# EAGLE design VCO-Simple-Back (EAGLE 9.1.0)

## Sheet 1 of 3: OSCILLATOR
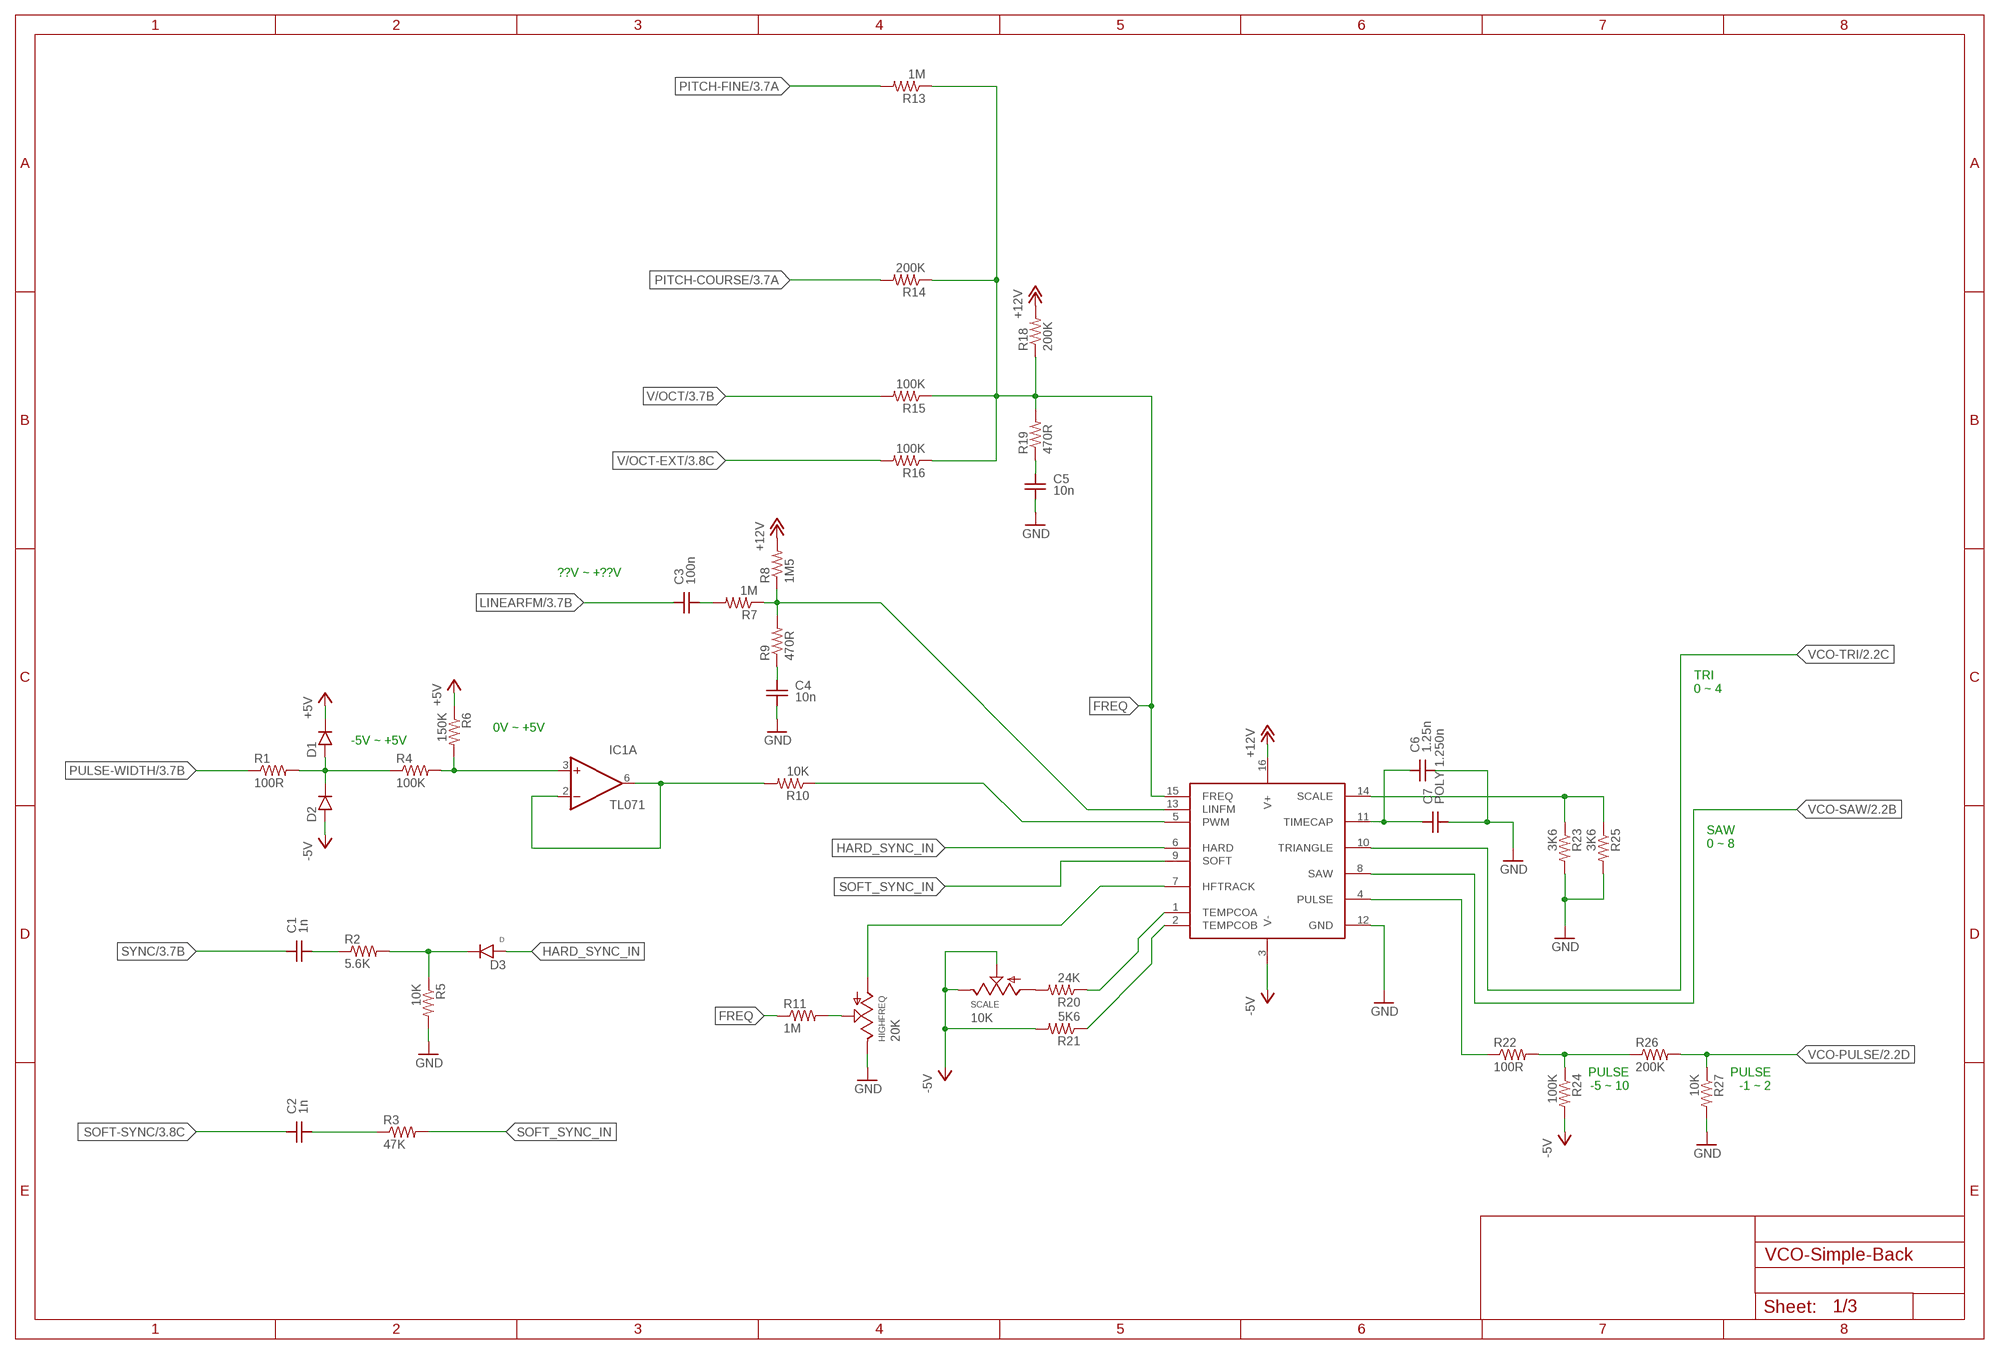
[diagram p0: schematic, sheet 1]

### Parts
C1  1n  CAPACITOR0805  [C-0805]
C2  1n  CAPACITOR0805  [C-0805]
C3  100n  CAPACITOR0805  [C-0805]
C4  10n  CAPACITOR0805  [C-0805]
C5  10n  CAPACITOR0805  [C-0805]
C6  1.25n  CAPACITOR0805  [C-0805]
C7  POLY 1.250n  CAPACITOR5MM  [CAP-5MM]
D1  DIODESOD-323  [SOD-323]
D2  DIODESOD-323  [SOD-323]
D3  D  DIODESOD-323  [SOD-323]
HIGHFREQ  20K  POTTRIM-MULTITURN-VERT  [POT-TRIM-MULTI-V]
IC1  TL071  OPAMP-SINGLE  [SO08]
IC2  V3340SO16  [SO16]
R1  100R  RESISTOR0805  [R-0805-MILL]
R2  5.6K  RESISTOR0805  [R-0805-MILL]
R3  47K  RESISTOR0805  [R-0805-MILL]
R4  100K  RESISTOR0805  [R-0805-MILL]
R5  10K  RESISTOR0805  [R-0805-MILL]
R6  150K  RESISTOR0805  [R-0805-MILL]
R7  1M  RESISTOR0805  [R-0805-MILL]
R8  1M5  RESISTOR0805  [R-0805-MILL]
R9  470R  RESISTOR0805  [R-0805-MILL]
R10  10K  RESISTOR0805  [R-0805-MILL]
R11  1M  RESISTOR0805  [R-0805-MILL]
R13  1M  RESISTOR0805  [R-0805-MILL]
R14  200K  RESISTOR0805  [R-0805-MILL]
R15  100K  RESISTOR0805  [R-0805-MILL]
R16  100K  RESISTOR0805  [R-0805-MILL]
R18  200K  RESISTOR0805  [R-0805-MILL]
R19  470R  RESISTOR0805  [R-0805-MILL]
R20  24K  RESISTOR0805  [R-0805-MILL]
R21  5K6  RESISTOR0805  [R-0805-MILL]
R22  100R  RESISTOR0805  [R-0805-MILL]
R23  3K6  RESISTOR0805  [R-0805-MILL]
R24  100K  RESISTOR0805  [R-0805-MILL]
R25  3K6  RESISTOR0805  [R-0805-MILL]
R26  200K  RESISTOR0805  [R-0805-MILL]
R27  10K  RESISTOR0805  [R-0805-MILL]
SCALE  10K  POTTRIM-MULTITURN-VERT  [POT-TRIM-MULTI-V]

### Nets
+5V [pwr]: D1.K(C) R6.P$1 ; also sheet 2,3
+12V [pwr]: IC2.16(V+) R8.P$2 R18.P$2 ; also sheet 2,3
-5V [pwr]: D2.A IC2.3(V-) R21.P$2 R24.P$2 SCALE.B(E) SCALE.W(S) ; also sheet 2,3
FREQ: IC2.15(FREQ) R11.P$1 R13.P$1 R14.P$1 R15.P$1 R16.P$1 R18.P$1 R19.P$2
GND [pwr]: C4.2 C5.2 C6.2 C7.2 HIGHFREQ.B(E) IC2.12(GND) R5.P$2 R23.P$2 R25.P$2 R27.P$2 ; also sheet 2,3
HARD_SYNC_IN: D3.A IC2.6(HARD)
LINEARFM: C3.1 ; also sheet 3
N$3: IC2.5(PWM) R10.P$1
N$4: C6.1 C7.1 IC2.11(TIMECAP)
N$8: HIGHFREQ.W(S) R11.P$2
N$9: R20.P$2 SCALE.A
N$10: IC2.2(TEMPCOB) R21.P$1
N$11: D3.K(C) R2.P$2 R5.P$1
N$12: IC2.14(SCALE) R23.P$1 R25.P$1
N$13: C5.1 R19.P$1
N$14: C3.2 R7.P$2
N$15: IC2.13(LINFM) R7.P$1 R8.P$1 R9.P$2
N$16: C4.1 R9.P$1
N$18: HIGHFREQ.A IC2.7(HFTRACK)
N$19: IC2.1(TEMPCOA) R20.P$1
N$20: D1.A D2.K(C) R1.P$2 R4.P$1
N$22: R22.P$2 R24.P$1 R26.P$1
N$32: C1.2 R2.P$1
N$43: C2.2 R3.P$1
N$44: IC1.3(A:+IN) R4.P$2 R6.P$2
PITCH-COURSE: R14.P$2 ; also sheet 3
PITCH-FINE: R13.P$2 ; also sheet 3
PULSE: IC2.4(PULSE) R22.P$1
PULSE-WIDTH: R1.P$1 ; also sheet 3
PWMIN: IC1.2(A:-IN) IC1.6(A:OUT) R10.P$2
SOFT-SYNC: C2.1 ; also sheet 3
SOFT_SYNC_IN: IC2.9(SOFT) R3.P$2
SYNC: C1.1 ; also sheet 3
V/OCT: R15.P$2 ; also sheet 3
V/OCT-EXT: R16.P$2 ; also sheet 3
VCO-PULSE: R26.P$2 R27.P$1 ; also sheet 2
VCO-SAW: IC2.8(SAW) ; also sheet 2
VCO-TRI: IC2.10(TRIANGLE) ; also sheet 2

### Notes on the sheet
- ??V ~ +??V
- TRI
  0 ~ 4
- 0V ~ +5V
- -5V ~ +5V
- SAW
  0 ~ 8
- PULSE
  -5 ~ 10
- PULSE
  -1 ~ 2

## Sheet 2 of 3: WAVESHAPING
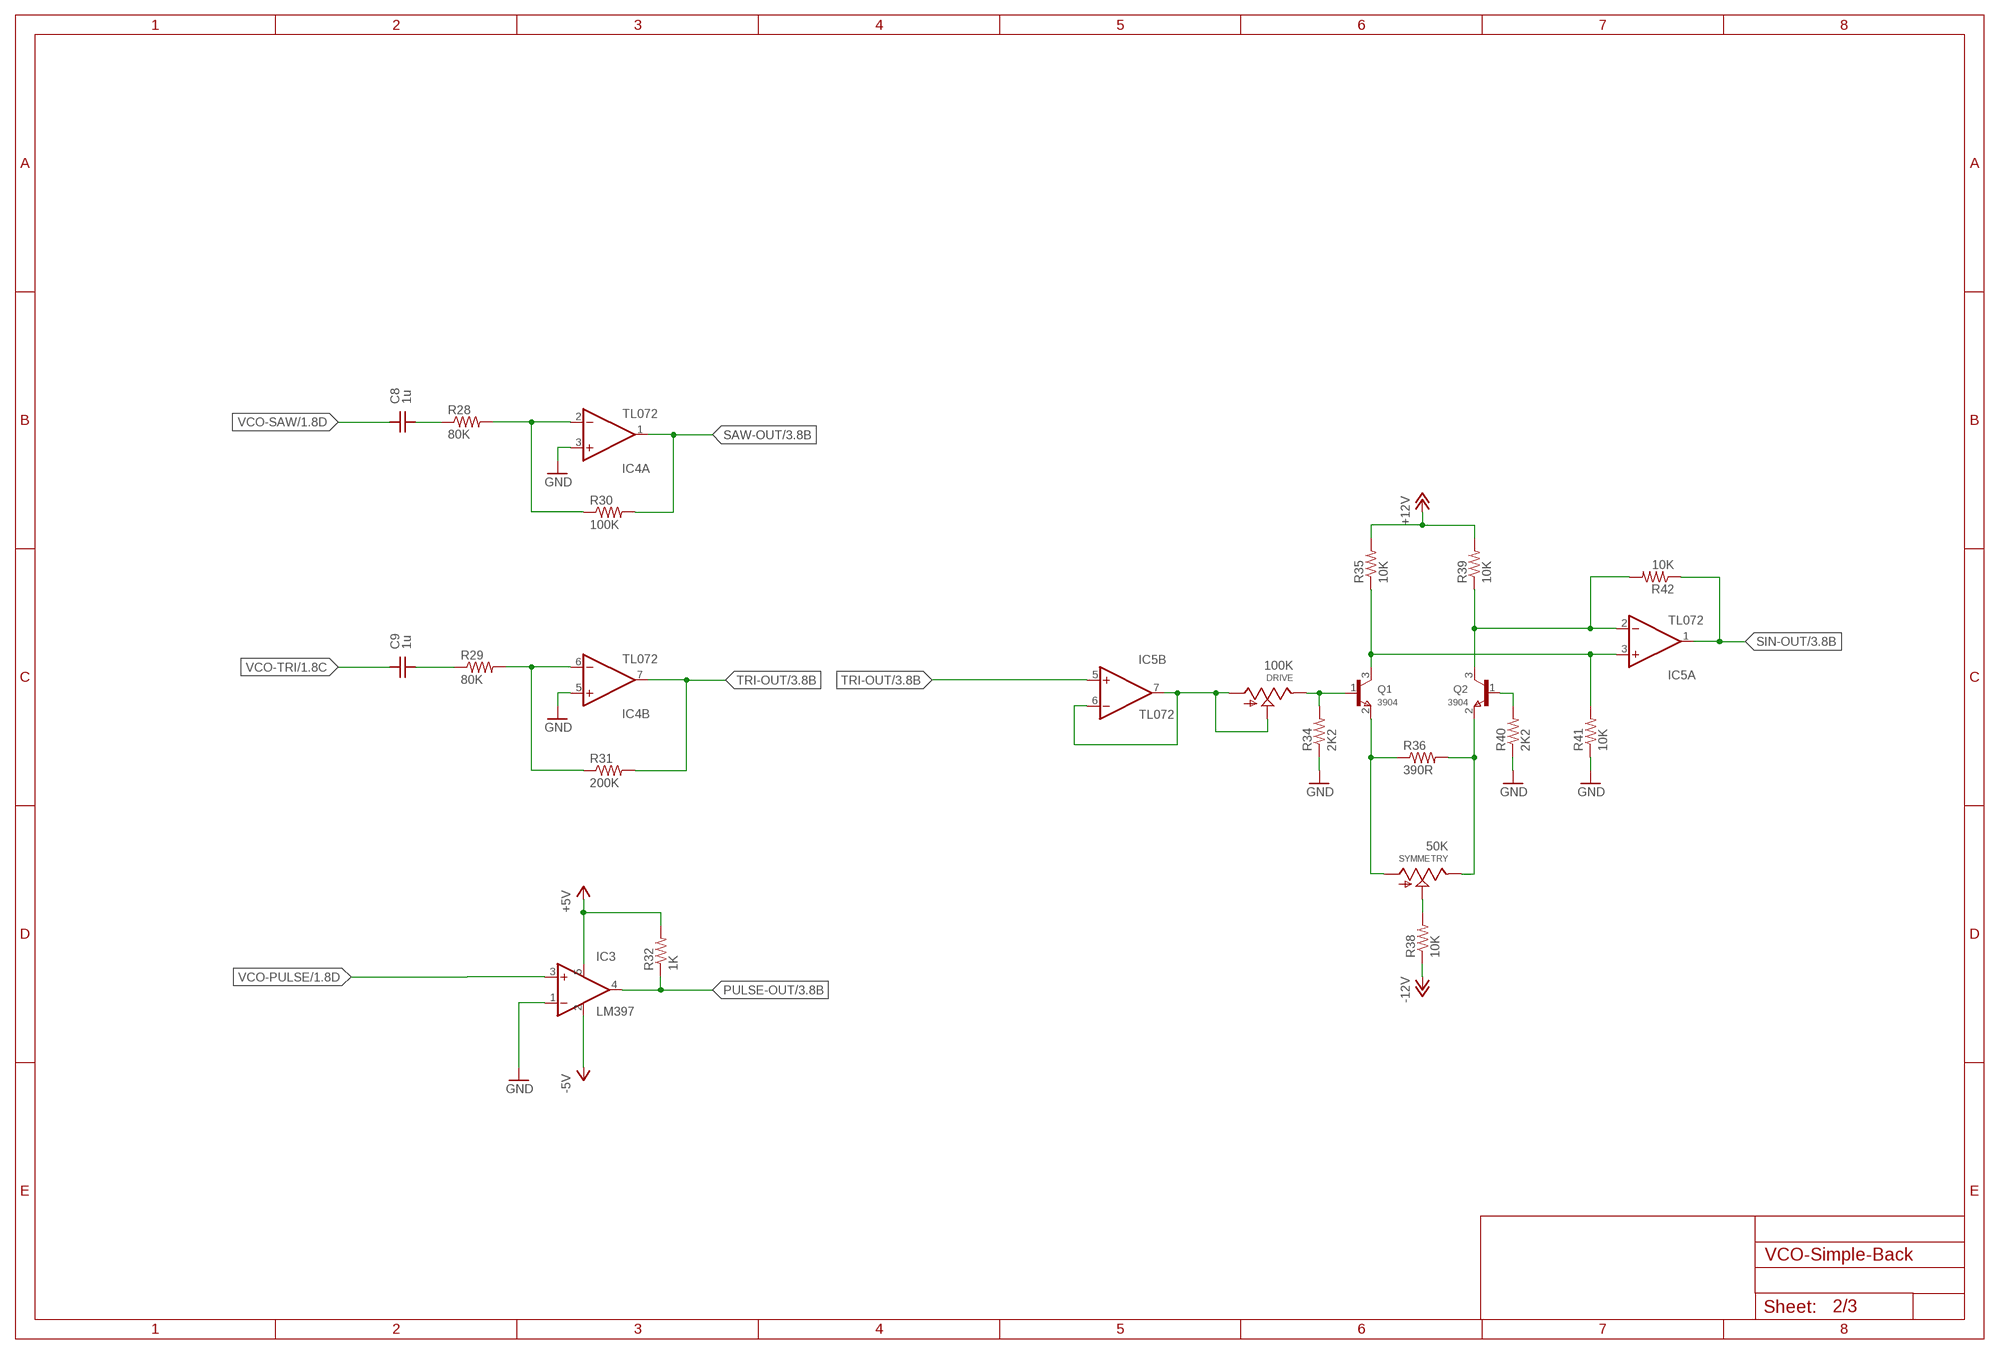
[diagram p1: schematic, sheet 2]

### Parts
C8  1u  CAPACITOR0805  [C-0805]
C9  1u  CAPACITOR0805  [C-0805]
DRIVE  100K  POTTRIM-MULTITURN-VERT  [POT-TRIM-MULTI-V]
IC3  LM397  [SOT23-5]
IC4  TL072  OPAMP-DUAL  [SO08]
IC5  TL072  OPAMP-DUAL  [SO08]
Q1  3904  TRANSISTOR-NPNMMBT3904  [SOT23]
Q2  3904  TRANSISTOR-NPNMMBT3904  [SOT23]
R28  80K  RESISTOR0805  [R-0805-MILL]
R29  80K  RESISTOR0805  [R-0805-MILL]
R30  100K  RESISTOR0805  [R-0805-MILL]
R31  200K  RESISTOR0805  [R-0805-MILL]
R32  1K  RESISTOR0805  [R-0805-MILL]
R34  2K2  RESISTOR0805  [R-0805-MILL]
R35  10K  RESISTOR0805  [R-0805-MILL]
R36  390R  RESISTOR0805  [R-0805-MILL]
R38  10K  RESISTOR0805  [R-0805-MILL]
R39  10K  RESISTOR0805  [R-0805-MILL]
R40  2K2  RESISTOR0805  [R-0805-MILL]
R41  10K  RESISTOR0805  [R-0805-MILL]
R42  10K  RESISTOR0805  [R-0805-MILL]
SYMMETRY  50K  POTTRIM-MULTITURN-VERT  [POT-TRIM-MULTI-V]

### Nets
+5V [pwr]: IC3.5(V+) R32.P$2 ; also sheet 1,3
+12V [pwr]: R35.P$2 R39.P$2 ; also sheet 1,3
-5V [pwr]: IC3.2(GND) ; also sheet 1,3
-12V: R38.P$1 ; also sheet 3
GND [pwr]: IC3.1(-IN) IC4.3(A:+IN) IC4.5(B:+IN) R34.P$1 R40.P$1 R41.P$1 ; also sheet 1,3
N$1: C8.2 R28.P$1
N$2: C9.2 R29.P$1
N$5: IC4.6(B:-IN) R29.P$2 R31.P$1
N$6: IC4.2(A:-IN) R28.P$2 R30.P$1
N$7: DRIVE.A DRIVE.W(S) IC5.6(B:-IN) IC5.7(B:OUT)
N$17: R38.P$2 SYMMETRY.W(S)
N$21: DRIVE.B(E) Q1.1(B) R34.P$2
N$23: Q1.2(E) R36.P$1 SYMMETRY.A
N$24: Q2.2(E) R36.P$2 SYMMETRY.B(E)
N$25: Q2.1(B) R40.P$2
N$27: IC5.2(A:-IN) Q2.3(C) R39.P$1 R42.P$2
N$28: IC5.3(A:+IN) Q1.3(C) R35.P$1 R41.P$2
PULSE-OUT: IC3.4(OUT) R32.P$1 ; also sheet 3
SAW-OUT: IC4.1(A:OUT) R30.P$2 ; also sheet 3
SIN-OUT: IC5.1(A:OUT) R42.P$1 ; also sheet 3
TRI-OUT: IC4.7(B:OUT) IC5.5(B:+IN) R31.P$2 ; also sheet 3
VCO-PULSE: IC3.3(+IN) ; also sheet 1
VCO-SAW: C8.1 ; also sheet 1
VCO-TRI: C9.1 ; also sheet 1

## Sheet 3 of 3: POWER
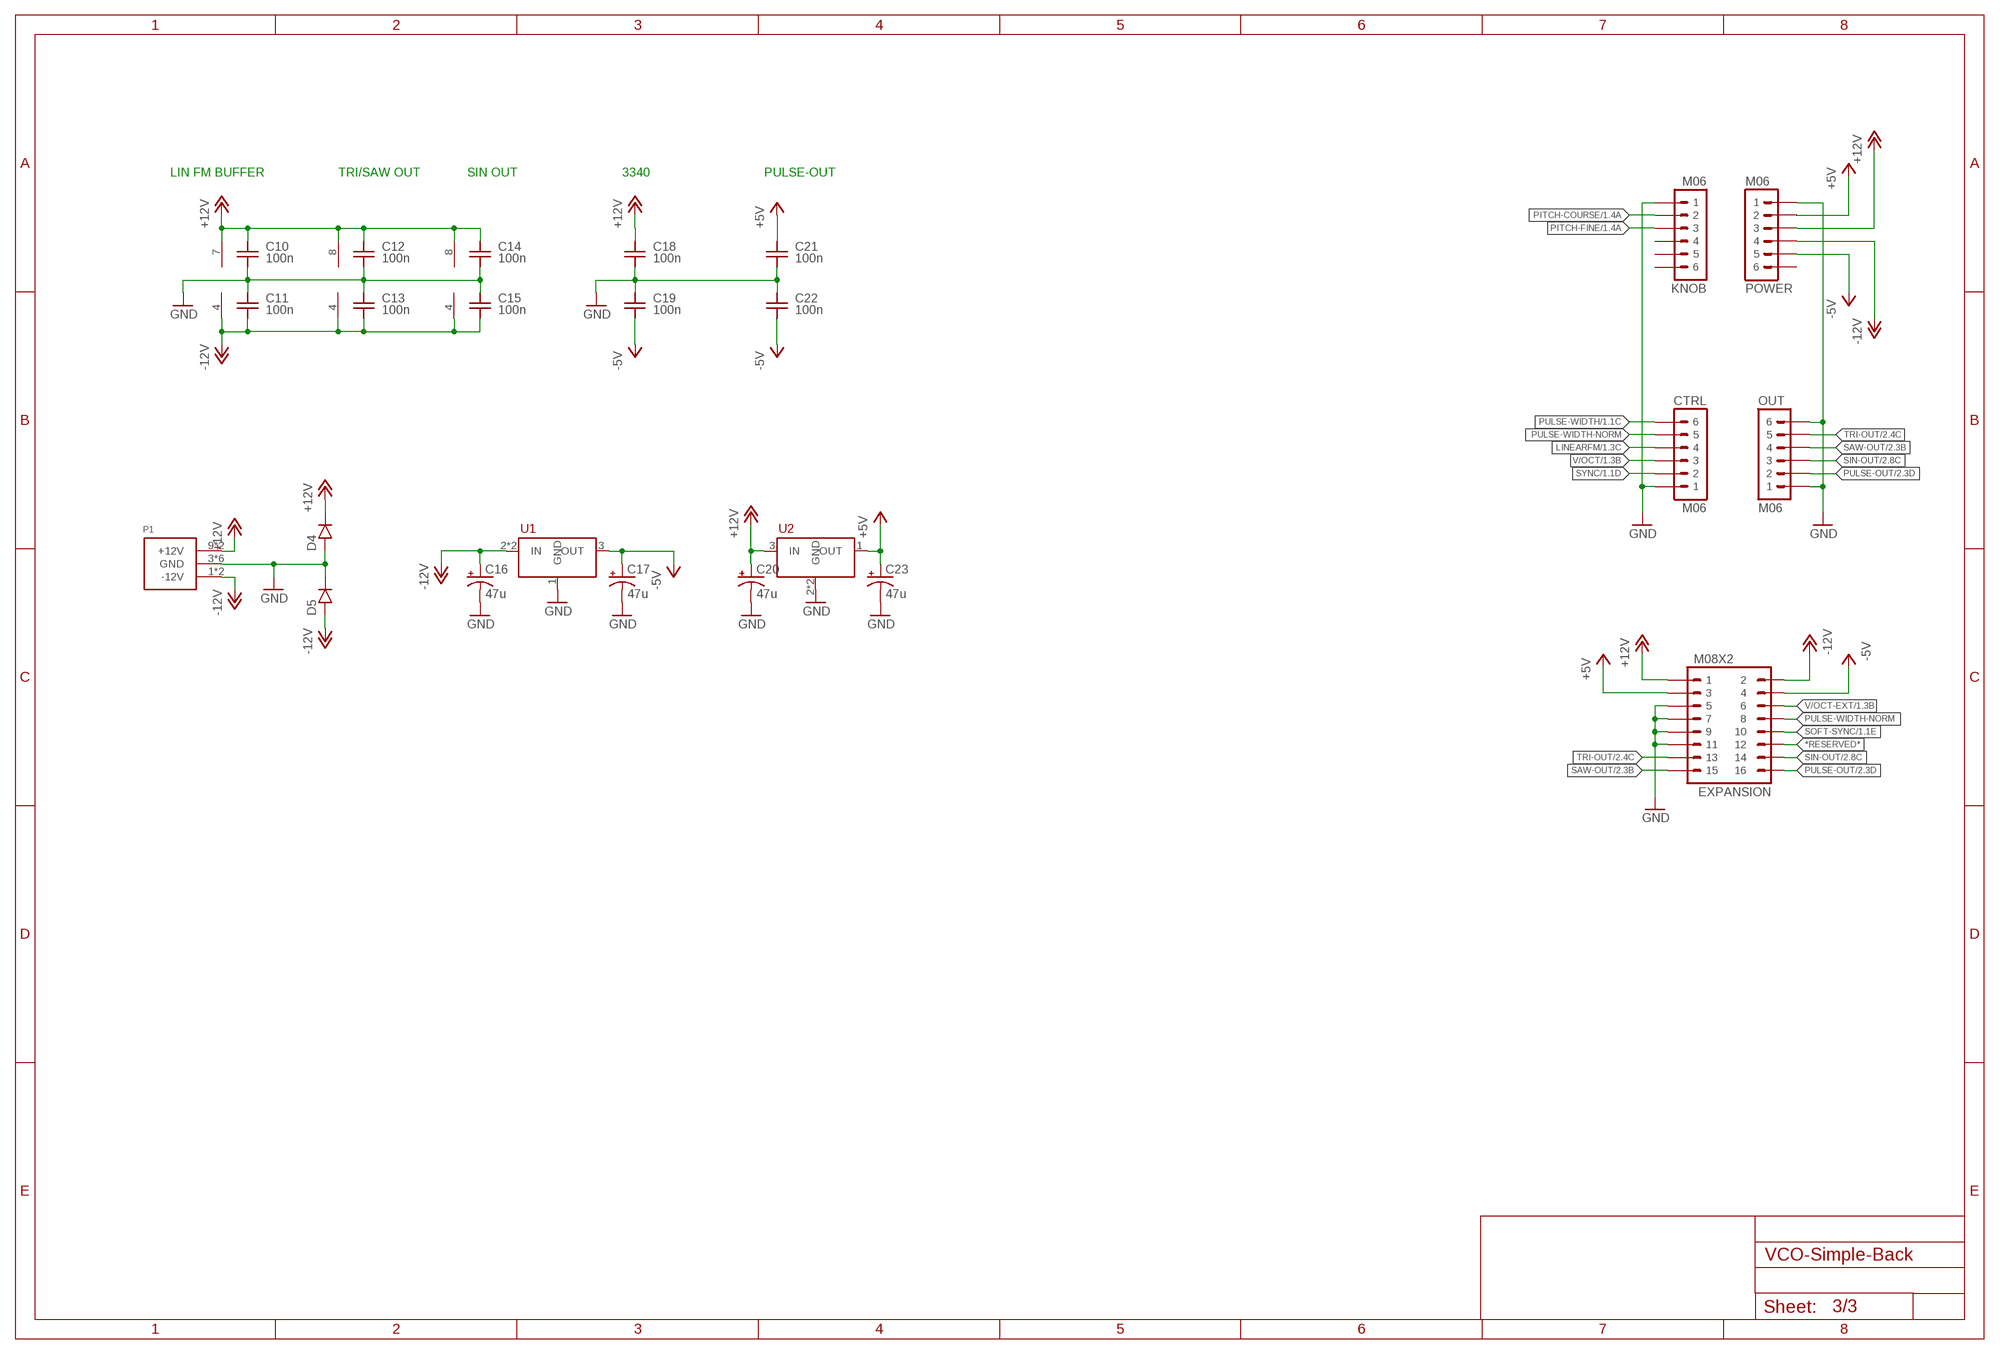
[diagram p2: schematic, sheet 3]

### Parts
C10  100n  CAPACITOR0805  [C-0805]
C11  100n  CAPACITOR0805  [C-0805]
C12  100n  CAPACITOR0805  [C-0805]
C13  100n  CAPACITOR0805  [C-0805]
C14  100n  CAPACITOR0805  [C-0805]
C15  100n  CAPACITOR0805  [C-0805]
C16  47u  CPOL-USC  [PANASONIC_C]
C17  47u  CPOL-USC  [PANASONIC_C]
C18  100n  CAPACITOR0805  [C-0805]
C19  100n  CAPACITOR0805  [C-0805]
C20  47u  CPOL-USC  [PANASONIC_C]
C21  100n  CAPACITOR0805  [C-0805]
C22  100n  CAPACITOR0805  [C-0805]
C23  47u  CPOL-USC  [PANASONIC_C]
CTRL  M06  [M06]
D4  DIODESOD-123  [SOD-123]
D5  DIODESOD-123  [SOD-123]
EXPANSION  M08X2  [M08X2]
KNOB  M06  [M06]
OUT  M06  [M06]
P1  POWER_SIMPLE10_SHROUDED  [POWER_10_SHROUDED]
POWER  M06  [M06]
U1  LM79L05A  [SOT89]
U2  MC78L05A  [SOT89]

### Nets
*RESERVED*: EXPANSION.12
+5V [pwr]: C21.1 C23.+ EXPANSION.3 POWER.2 U2.1(OUT) ; also sheet 1,2
+12V [pwr]: C10.1 C12.1 C14.1 C18.1 C20.+ D4.K(C) EXPANSION.1 IC1.7(POWER:V+) IC4.8(POWER:V+) IC5.8(POWER:V+) P1.9(+12V) P1.10(+12V) POWER.3 U2.3(IN) ; also sheet 1,2
-5V [pwr]: C17.+ C19.2 C22.2 EXPANSION.4 POWER.5 U1.3(OUT) ; also sheet 1,2
-12V: C11.2 C13.2 C15.2 C16.+ D5.A EXPANSION.2 IC1.4(POWER:V-) IC4.4(POWER:V-) IC5.4(POWER:V-) P1.1(-12V) P1.2(-12V) POWER.4 U1.2(IN) U1.2B(IN) ; also sheet 2
GND [pwr]: C10.2 C11.1 C12.2 C13.1 C14.2 C15.1 C16.- C17.- C18.2 C19.1 C20.- C21.2 C22.1 C23.- CTRL.1 D4.A D5.K(C) EXPANSION.5 EXPANSION.7 EXPANSION.9 EXPANSION.11 KNOB.1 OUT.1 OUT.6 P1.3(GND) P1.4(GND) P1.5(GND) P1.6(GND) P1.7(GND) P1.8(GND) POWER.1 U1.1(GND) U2.2(GND) U2.2B(GND) ; also sheet 1,2
LINEARFM: CTRL.4 ; also sheet 1
PITCH-COURSE: KNOB.2 ; also sheet 1
PITCH-FINE: KNOB.3 ; also sheet 1
PULSE-OUT: EXPANSION.16 OUT.2 ; also sheet 2
PULSE-WIDTH: CTRL.6 ; also sheet 1
PULSE-WIDTH-NORM: CTRL.5 EXPANSION.8
SAW-OUT: EXPANSION.15 OUT.4 ; also sheet 2
SIN-OUT: EXPANSION.14 OUT.3 ; also sheet 2
SOFT-SYNC: EXPANSION.10 ; also sheet 1
SYNC: CTRL.2 ; also sheet 1
TRI-OUT: EXPANSION.13 OUT.5 ; also sheet 2
V/OCT: CTRL.3 ; also sheet 1
V/OCT-EXT: EXPANSION.6 ; also sheet 1
Unconnected: KNOB.4 KNOB.5 KNOB.6 POWER.6

### Notes on the sheet
- LIN FM BUFFER | TRI/SAW OUT | SIN OUT | 3340 | PULSE-OUT

## Library data of the parts
C1-C15 C18 C19 C21 C22 = barsstronics:CAPACITOR
C16 C17 C20 C23 = rcl:CPOL-US: POLARIZED CAPACITOR, American symbol; SPICEPREFIX: C
CTRL KNOB OUT POWER = barsstronics:M06
D1-D5 = barsstronics:DIODE
DRIVE HIGHFREQ SCALE SYMMETRY = barsstronics:POT
EXPANSION = barsstronics:M08X2
IC1 = barsstronics:OPAMP-SINGLE
IC2 = barsstronics:V3340
IC3 = barsstronics:LM397: 7 Single General-Purpose Voltage Comparator
IC4 IC5 = barsstronics:OPAMP-DUAL: Generic Dual Op-Amp
P1 = eurorack:POWER_SIMPLE
Q1 Q2 = barsstronics:TRANSISTOR-NPN
R1-R11 R13-R16 R18-R32 R34-R36 R38-R42 = barsstronics:RESISTOR
U1 = barsstronics:LM79L05A
U2 = barsstronics:MC78L05A

## Net classes
0 default: width 0.254 mm
1 pwr: width 0.61 mm

## Board
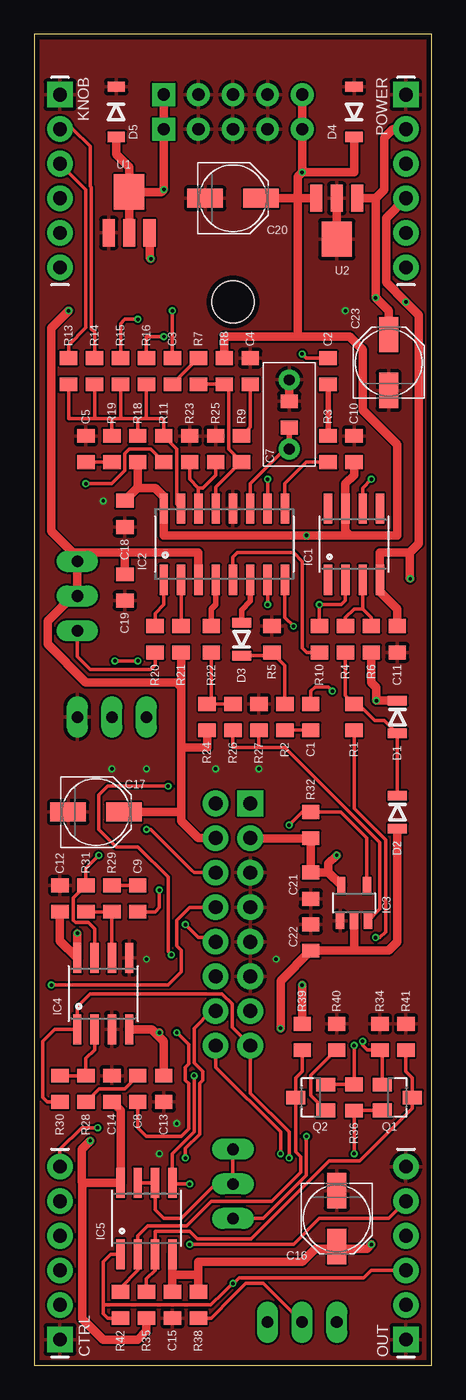
[diagram p3: board, top side]
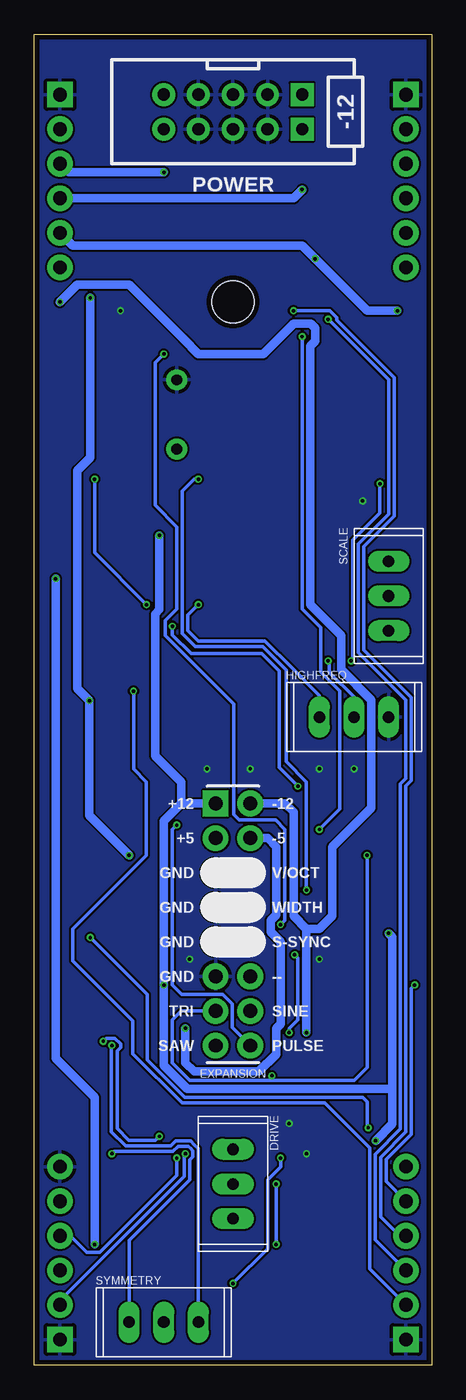
[diagram p4: board, bottom side, seen from below]

Size 29.21 x 97.79 mm. Coordinates in mm from the lower left corner, seen from the top.
Outline: 0,0 29.21,0 29.21,97.79 0,97.79 0,0
Copper layers (1*16): Top 0.035559375mm / dielectric 1.6mm / Bottom 0.035559375mm
Design rules "oshpark-2layer": minimum track width 6mil, minimum drill 10mil, track to track 6mil, track to pad 6mil, pad to pad 6mil, via to via 6mil, smd to smd 6mil, copper to edge 15mil, drill to drill 6mil, minimum pad ring 5mil, minimum via ring 5mil, stop-mask expansion 2.5mil, vias tented up to drill 0mil, thermal gap 10mil
Holes 3.1 mm at 14.61,78.1
tKeepout: area 12.1,75.6 to 17.1,80.6; area 12.1,75.6 to 17.1,80.6

### Footprints (pad centres in the part's own frame; a part is rotated, then mirrored left to right if it is on the bottom)
C-0805 = smd 1.016 x 1.27: 1 -0.965,0; 2 0.965,0
CAP-5MM = drill 0.8 pad 1.524: 1 -2.54,0; 2 2.54,0
PANASONIC_C = smd 2.6 x 1.4: + 2.05,0; - -2.05,0
M06 = drill 1.016 pad 1.88 square: 1 0,0 | drill 1.016 pad 1.88: 2 2.54,0; 3 5.08,0; 4 7.62,0; 5 10.16,0; 6 12.7,0
SOD-323 = smd 0.7 x 1.4: A -1.2,0; K 1.2,0
SOD-123 = smd 0.762 x 1.27: A -1.85,0; K 1.85,0
POT-TRIM-MULTI-V = drill 0.85 pad 1.524 long: A -2.54,0; B 2.54,0; W 0,0
M08X2 = drill 1.016 pad 1.88 square: 1 0,0 | drill 1.016 pad 1.88: 2 0,2.54; 3 2.54,0; 4 2.54,2.54; 5 5.08,0; 6 5.08,2.54; 7 7.62,0; 8 7.62,2.54; 9 10.16,0; 10 10.16,2.54; 11 12.7,0; 12 12.7,2.54; 13 15.24,0; 14 15.24,2.54; 15 17.78,0; 16 17.78,2.54
SO08 = smd 0.61 x 2.21: 1 -1.905,-2.616; 2 -0.635,-2.616; 3 0.635,-2.616; 4 1.905,-2.616; 5 1.905,2.616; 6 0.635,2.616; 7 -0.635,2.616; 8 -1.905,2.616
SO16 = smd 0.61 x 2.21: 1 -4.445,-2.616; 2 -3.175,-2.616; 3 -1.905,-2.616; 4 -0.635,-2.616; 5 0.635,-2.616; 6 1.905,-2.616; 7 3.175,-2.616; 8 4.445,-2.616; 9 4.445,2.616; 10 3.175,2.616; 11 1.905,2.616; 12 0.635,2.616; 13 -0.635,2.616; 14 -1.905,2.616; 15 -3.175,2.616; 16 -4.445,2.616
SOT23-5 = smd 0.6 x 1.2: 1 -1.026,-1.306; 2 0,-1.306; 3 1.026,-1.306; 4 0.95,1.306; 5 -0.95,1.306
POWER_10_SHROUDED = drill 0.9 pad 1.676 square: 1 -5.08,-1.27; 2 -5.08,1.27 | drill 0.9 pad 1.676: 3 -2.54,-1.27; 4 -2.54,1.27; 5 0,-1.27; 6 0,1.27; 7 2.54,-1.27; 8 2.54,1.27; 9 5.08,-1.27; 10 5.08,1.27
SOT23 = smd 1 x 1.4: 1 -0.95,-1.1; 2 0.95,-1.1; 3 0,1.1
R-0805-MILL = smd 1.016 x 1.27: P$1 -0.965,0; P$2 0.965,0
SOT89 = smd 0.9 x 2: 1 -1.5,0; 2 0,0; 3 1.5,0 | smd 2.23 x 2.6: 2B 0,3

### Placement (x,y rotation side)
C1  20.32,47.62 270 top
C2  21.59,73.02 270 top
C3  10.16,73.02 270 top
C4  15.88,73.02 90 top
C5  3.81,67.31 90 top
C6  18.73,69.85 90 top
C7  18.73,69.85 90 top
C8  7.62,20.32 90 top
C9  7.62,34.29 90 top
C10  23.49,67.31 90 top
C11  26.67,53.34 90 top
C12  1.91,34.29 90 top
C13  9.53,20.32 90 top
C14  5.71,20.32 90 top
C15  10.16,4.45 90 top
C16  22.22,10.79 270 top
C17  4.55,40.64 0 top
C18  6.67,62.55 270 top
C19  6.67,57.15 90 top
C20  14.61,85.72 0 top
C21  20.32,35.24 270 top
C22  20.32,31.43 270 top
C23  26.04,73.66 90 top
CTRL  1.91,1.91 90 top
D1  26.67,47.62 90 top
D2  26.67,40.64 90 top
D3  15.24,53.34 270 top
D4  23.49,92.07 270 top
D5  6.03,92.07 90 top
DRIVE  14.61,13.34 270 bottom
EXPANSION  15.88,41.27 270 bottom
HIGHFREQ  5.71,47.62 0 bottom
IC1  23.49,60.33 0 top
IC2  13.97,60.33 0 top
IC3  23.49,33.97 0 top
IC4  5.08,27.3 0 top
IC5  8.26,10.79 0 top
KNOB  1.91,93.34 270 top
OUT  27.3,1.91 90 top
P1  14.61,92.07 180 bottom
POWER  27.3,93.34 270 top
Q1  26.67,19.68 270 top
Q2  20.32,19.68 90 top
R1  23.49,47.62 90 top
R2  18.41,47.62 90 top
R3  21.59,67.31 270 top
R4  22.86,53.34 90 top
R5  17.46,53.34 90 top
R6  24.76,53.34 90 top
R7  12.06,73.02 90 top
R8  13.97,73.02 90 top
R9  15.24,67.31 270 top
R10  20.95,53.34 90 top
R11  9.53,67.31 270 top
R13  2.54,73.02 90 top
R14  4.45,73.02 90 top
R15  6.35,73.02 90 top
R16  8.26,73.02 90 top
R18  7.62,67.31 270 top
R19  5.71,67.31 90 top
R20  8.89,53.34 270 top
R21  10.79,53.34 270 top
R22  13.02,53.34 270 top
R23  11.43,67.31 90 top
R24  12.7,47.62 270 top
R25  13.34,67.31 90 top
R26  14.61,47.62 270 top
R27  16.51,47.62 90 top
R28  3.81,20.32 90 top
R29  5.71,34.29 270 top
R30  1.91,20.32 270 top
R31  3.81,34.29 90 top
R32  20.32,39.69 270 top
R34  25.4,24.13 270 top
R35  8.26,4.45 270 top
R36  23.49,19.68 90 top
R38  12.06,4.45 270 top
R39  19.68,24.13 90 top
R40  22.22,24.13 270 top
R41  27.3,24.13 270 top
R42  6.35,4.45 90 top
SCALE  3.17,56.52 90 bottom
SYMMETRY  19.68,3.17 0 bottom
U1  6.99,83.18 0 top
U2  22.22,85.72 180 top

### Tracks (layer width: path | path; a pad name or v marks a point on that pad's centre or on a via)
+5V  (via drill 0.25)
  Top 0.61: IC3.5 21.62,36.21 | 21.62,36.21 C21.1 R32.P$2 15.89,38.72 EXPANSION.3 | D1.K v25.14,48.83 25.14,49.78 24.76,50.15 R6.P$1 | POWER.2 26.35,90.8 25.72,90.17 25.72,86.36 25.08,85.72 | 25.08,85.72 U2.1 | 25.08,85.72 25.08,79.38 25.08,79.25 v25.08,78.42 26.04,77.47 C23.+ | v22.22,37.47 21.62,36.86 21.62,36.21
  Bottom 0.61: v22.22,37.47 25.14,40.38 v25.14,48.83 26.04,49.72 26.04,65.72 25.08,66.67 v25.08,78.42
+12V  (via drill 0.25)
  Top 0.61: R35.P$2 8.26,2.54 7.62,1.91 5.08,1.91 3.54,3.44 3.54,13.39 3.57,13.41 | C10.1 23.49,65.41 22.86,64.77 IC1.7 22.86,61.28 23.18,60.96 | 7.62,64.77 7.62,64.46 C18.1 | 7.62,64.77 R18.P$2 | 26.04,60.96 23.18,60.96 | 26.04,60.96 v20,60.96 | v20,60.96 9.53,60.96 IC2.16 9.53,63.82 8.89,64.45 7.62,64.45 7.62,64.77 | 26.04,60.96 26.67,60.96 26.67,67.63 24.13,70.17 24.13,74.61 23.18,75.56 19.68,75.56 19.37,75.56 | C12.1 1.91,31.19 IC4.8 v3.17,31.75 | 3.57,13.41 4.76,13.41 IC5.8 6.35,18.72 C14.1 | 3.57,13.41 3.49,13.49 3.49,15.88 v4.13,16.51 | R8.P$2 13.97,75.56 19.37,75.56 | U2.3 19.68,85.72 19.37,85.72 | 19.37,85.72 19.37,75.56 | P1.9 P1.10 v19.68,87.63 | R39.P$2 v19.68,27.94 | D4.K 23.49,87.63 v19.68,87.63 | 23.18,60.96 v20,60.96 | 19.37,85.72 19.37,87.31 v19.68,87.63 | C20.+ 19.37,85.72
  Bottom 0.61: 18.41,41.27 19.68,40.01 v19.68,27.94 19.68,22.03 17.97,20.32 2.9,20.32 | EXPANSION.1 18.41,41.27 | POWER.3 26.67,87.63 23.49,87.63 v19.68,87.63 | v20,60.96 20,55.51 20.32,55.19 20.32,44.77 18.41,42.86 18.41,41.27 | v3.17,31.75 2.9,31.47 2.9,20.92 2.9,20.32 | v4.13,16.51 2.9,17.74 2.9,20.32
-5V  (via drill 0.25)
  Top 0.61: 23.49,30.48 23.48,30.47 C22.2 18.1,28.24 v18.1,24.76 | 23.49,30.48 IC3.2 | 10.79,45.4 12.7,45.4 R24.P$2 | IC2.3 12.06,59.69 8.26,59.69 6.99,59.69 6.67,59.69 | 6.67,59.69 5.71,59.69 5.4,59.69 3.17,59.69 | EXPANSION.4 12.06,38.73 10.79,40.01 10.79,40.64 | 10.79,40.64 10.79,45.4 | D2.A 26.67,31.11 26.04,30.48 23.49,30.48 | R21.P$2 10.79,50.16 10.79,49.85 | 10.79,49.85 10.79,49.53 10.79,45.4 | v2.54,77.47 1.27,76.2 1.27,61.28 2.86,59.69 3.17,59.69 | C17.+ 10.79,40.64 | U1.3 8.48,81.37 v8.57,81.28 | 3.17,59.69 SCALE.B SCALE.W 2.86,56.52 1,54.66 1,52.97 3.81,50.16 10.48,50.16 10.79,49.85 | C19.2 6.67,59.69
  Bottom 0.61: POWER.5 26.35,82.23 9.53,82.23 v8.57,81.28 4.76,77.47 v2.54,77.47 | v18.1,24.76 18.1,22.22 17.46,21.59 12.7,21.59 11.43,22.86 11.43,24.76 11.11,25.08 11.11,31.11 11.82,31.83 11.82,32.68 11.43,33.07 11.43,38.1 12.06,38.73 EXPANSION.4
-12V  (via drill 0.25)
  Top 0.61: C11.2 26.67,55.56 25.4,56.83 IC1.4 25.4,59.69 26.04,59.69 27.57,59.69 | C13.2 9.53,23.49 9.53,23.81 9.05,24.29 | IC4.4 8.65,24.69 9.05,24.29 | U1.2B U1.2 | U1.2B 9.35,86.18 v9.53,86.36 9.53,88.27 9.53,89.22 9.53,90.08 P1.2 P1.1 | IC5.4 10.16,7.62 10.16,7.3 10.16,6.67 | v27.62,57.79 27.57,57.84 27.57,59.69 | 9.05,24.29 v9.21,24.45 | POWER.4 25.84,84.27 25.84,79.57 v27.3,78.1 28.26,77.15 28.26,60.38 27.57,59.69 | 22.05,8.57 20.64,8.57 19.68,7.62 12.06,7.62 12.06,6.67 | 22.05,8.57 C16.+ | v24.76,8.89 24.45,8.57 22.05,8.57 | U1.2B 6.99,88 6.03,88.95 D5.A | R38.P$1 12.06,6.35 12.06,6.67 | C15.2 10.16,6.35 10.16,6.67 | 12.06,6.67 10.16,6.67
  Bottom 0.61: v24.76,8.89 24.76,19.68 27.62,22.54 27.62,43.18 27.62,43.82 v27.62,57.79 | EXPANSION.2 10.79,41.27 10.16,40.64 10.16,33.02 9.21,32.07 | v9.21,24.45 9.21,32.07 | v27.3,78.1 26.04,79.38 22.22,79.38 18.26,75.41 17.14,74.3 12.38,74.3 10.16,76.52 8.89,76.52 8.57,76.2 8.57,75.25 8.94,74.88 8.94,55.88 6.67,53.61 6.67,51.12 4.45,48.9 4.45,40.96 7.3,38.1 7.3,33.02 8.26,32.07 9.21,32.07 | POWER.4 10.16,85.72 v9.53,86.36
FREQ
  Top 0.254: R13.P$1 2.54,69.53 4.45,69.53 | 4.45,69.53 5.71,69.53 | 6.35,69.53 7.62,69.53 | 8.26,69.53 9.53,69.53 9.53,69.21 R11.P$1 10.48,67.32 10.48,63.26 IC2.15 | 8.26,69.53 R16.P$1 | R18.P$1 7.62,69.53 | R15.P$1 6.35,69.53 | R14.P$1 4.45,69.53 | R19.P$2 5.71,69.53 | 5.71,69.53 6.35,69.53 | 7.62,69.53 8.26,69.53
GND  (via drill 0.25)
  Top 0.61: C6.2 C7.2 | U2.2 U2.2B
  other vias: 22.86,77.47 8.26,29.84 17.78,29.84 9.21,15.56 10.48,17.78 13.34,43.82 8.26,43.82 16.51,43.82 5.71,43.82 5.08,63.5
  pour Top: 29.21,97.79 29.21,0 0,0 0,97.79
  pour Bottom: 29.21,97.79 29.21,0 0,0 0,97.79
HARD_SYNC_IN
  Top 0.406: IC2.6 15.88,56.13 15.24,55.49 D3.A
LINEARFM  (via drill 0.25)
  Top 0.254: C3.1 v10.16,77.47
  Bottom 0.254: CTRL.4 2.36,9.53 3.76,10.93 3.76,15.29 1.91,17.14 1.91,42.55 1.5,42.95 1.5,49.06 4.99,52.55 4.99,60.16 2.77,62.38 2.77,72.56 6.99,76.77 6.99,76.95 7.5,77.47 v10.16,77.47
N$1
  Top 0.254: R28.P$1 4.78,20.32 6.66,20.32 C8.2
N$2
  Top 0.254: R29.P$1 C9.2
N$3
  Top 0.254: IC2.5 14.61,59.37 14.92,59.69 19.05,59.69 19.68,59.05 19.68,52.71 20.01,52.38 R10.P$1
N$4
  Top 0.254: IC2.11 15.88,64.77 18.41,67.31 C7.1
  Top 0.406: C7.1 C6.1
N$5
  Top 0.254: IC4.6 R29.P$2 R31.P$1
N$6
  Top 0.254: IC4.2 4.45,23.18 3.81,22.54 R28.P$2 R30.P$1
N$7
  Top 0.254: IC5.7 IC5.6 8.89,11.43 9.53,10.79 10.79,10.79 13.34,13.34 DRIVE.W DRIVE.A
N$8  (via drill 0.25)
  Top 0.254: R11.P$2 8.56,67.31 6.99,67.31 6.67,66.99 6.67,65.72 5.71,64.77 v3.81,64.77 | v7.62,51.75 v5.93,51.75
  Bottom 0.254: HIGHFREQ.W 5.71,49.08 7.53,50.89 7.53,51.66 v7.62,51.75 | v3.81,64.77 3.81,62.61 5.8,60.61 5.8,55.56 5.8,51.88 v5.93,51.75
N$9
  Top 0.254: R20.P$2 8.89,51.44 8.57,51.12 4.13,51.12 3.17,52.07 SCALE.A
N$10
  Top 0.254: R21.P$1 IC2.2
N$11
  Top 0.254: D3.K 17.23,52.14 R5.P$1 18.41,51.42 R2.P$2
N$12
  Top 0.254: IC2.14 12.06,64.13 12.06,64.45 | 12.06,64.45 11.43,65.09 R23.P$1 | 12.06,64.45 12.38,64.45 13.34,65.41 R25.P$1
N$13
  Top 0.254: C5.1 R19.P$1
N$14
  Top 0.254: C3.2 10.16,72.08 R7.P$2
N$15
  Top 0.254: R7.P$1 R8.P$1 14.29,71.74 14.29,67.3 R9.P$2 15.17,66.34 15.05,66.23 13.34,64.51 IC2.13
N$16
  Top 0.254: C4.1 15.88,68.91 R9.P$1
N$17
  Top 0.254: R38.P$2 13.01,3.48 14.61,5.08 15.56,6.03 16.83,6.03 SYMMETRY.W
N$18  (via drill 0.25)
  Top 0.254: v17.14,55.88 IC2.7
  Bottom 0.254: 12.38,53.21 17.14,53.21 17.91,53.98 17.91,55.12 v17.14,55.88 | 12.38,53.21 12.27,53.21 | 12.38,53.21 12.27,53.21 | 12.27,53.21 10.3,51.25 8.26,49.2 HIGHFREQ.A
N$19
  Top 0.254: R20.P$1 8.89,55.25 9.53,55.88 IC2.1
N$20
  Top 0.254: R4.P$1 22.86,49.23 22.86,49.21 23.16,48.91 23.48,48.59 R1.P$2 23.8,48.59 25.01,47.38 25.72,47.38 D1.A D2.K
N$21  (via drill 0.25)
  Top 0.254: Q1.1 25.57,22.99 R34.P$2 25.39,23.18 24.45,23.18 24.13,23.49 v24.13,23.81 | DRIVE.B 16.83,10.79 20,13.97 v20,16.83
  Bottom 0.254: v24.13,23.81 23.91,24.03 23.27,24.03 22.86,23.61 22.86,23.38 23.12,23.12 23.12,17.4 22.24,16.53 20.3,16.53 v20,16.83
N$22
  Top 0.254: R22.P$2 13.02,48.91 R24.P$1 R26.P$1
N$23  (via drill 0.25)
  Top 0.254: Q1.2 25.55,18.72 24.76,18.72 24.45,18.72 R36.P$1 v23.49,15.56
  Bottom 0.254: v23.49,15.56 23.34,15.72 19.01,15.72 18.64,16.09 17.88,16.09 17.72,15.94 17.56,15.78 17.56,15.34 17.78,15.12 17.78,13.65 22.22,9.21 SYMMETRY.A
N$24  (via drill 0.25)
  Top 0.254: Q2.2 23.48,20.63 R36.P$2 v23.49,23.49
  Bottom 0.254: v23.49,23.49 23.49,23.31 23.52,23.29 23.52,17.17 22.47,16.12 19.18,16.12 18.8,16.5 17.71,16.5 17.43,16.22 17.16,15.95 17.16,3.19 SYMMETRY.B
N$25
  Top 0.254: Q2.1 20.32,19.83 20.32,21.31 22.22,23.21 22.22,23.18 R40.P$2
N$27
  Top 0.254: R42.P$2 6.35,5.71 7.62,6.99 IC5.2 7.62,9.53 8.26,10.16 8.34,10.25 11.2,10.25 13.02,12.06 17.46,12.06 19.6,14.2 19.6,15.33 19.22,15.71 Q2.3 19.22,21.12 19.68,21.59 R39.P$1
N$28
  Top 0.254: R35.P$1 8.26,6.35 8.89,6.99 IC5.3 8.89,9.84 11.43,9.84 11.98,9.3 15.96,9.3 21.69,15.02 23.91,15.02 27.77,18.88 Q1.3 27.77,21.12 27.3,21.59 R41.P$2
N$32
  Top 0.254: R2.P$1 C1.2
N$43
  Top 0.406: C2.2 R3.P$1
N$44
  Top 0.254: R4.P$2 22.86,54.93 23.49,55.56 24.13,55.56 | 24.13,55.56 24.76,54.93 R6.P$2 | IC1.3 24.13,55.56
PITCH-COURSE
  Top 0.254: KNOB.2 2.86,90.8 4.13,89.53 4.13,86.62 4.22,86.53 4.22,76.11 4.45,75.88 R14.P$2
PITCH-FINE
  Top 0.254: KNOB.3 3.81,86.36 3.81,76.21 2.54,74.94 R13.P$2
PULSE
  Top 0.406: IC2.4 13.34,55.88 13.02,55.56 R22.P$1
PULSE-OUT  (via drill 0.25)
  Top 0.254: IC3.4 24.44,36.2 24.44,38.74 22.53,40.65 R32.P$1 19.7,40.65 v18.73,39.69 | v18.1,15.56 18.1,17.14 13.34,21.91 EXPANSION.16
  Bottom 0.254: v18.1,15.56 18.1,15.38 18.19,15.29 18.19,13.88 27.3,4.76 OUT.2 | EXPANSION.16 14.66,24.82 14.66,26.54 15.37,27.25 18.36,27.25 19.05,27.94 19.05,39.37 v18.73,39.69
PULSE-WIDTH  (via drill 0.25)
  Top 0.254: R1.P$1 23.49,40.9 25.81,38.59 25.81,33.66 25.81,31.84 25.4,31.43 v25.08,31.43 | v4.67,17.46 3.49,17.46 1.91,15.88 CTRL.6
  Bottom 0.254: v25.08,31.43 20.9,27.25 20.9,22.43 18.16,19.68 5.08,19.68 4.76,19.37 4.76,17.46 v4.67,17.46
PULSE-WIDTH-NORM  (via drill 0.25)
  Top 0.254: EXPANSION.8 11.43,33.66 10.48,32.7 10.48,30.8 10.79,30.48 10.79,30.16 10.79,28.89 9.84,27.94 v1.27,27.94
  Bottom 0.254: CTRL.5 3.35,13.51 3.35,15.12 1.5,16.98 1.5,27.71 v1.27,27.94
PWMIN  (via drill 0.25)
  Top 0.254: IC1.2 22.86,56.2 22.54,55.88 v20.95,55.88 R10.P$2 | v24.76,65.09 24.13,64.45 IC1.6
  Bottom 0.254: v20.95,55.88 24.76,59.69 v24.76,65.09
SAW-OUT  (via drill 0.25)
  Top 0.254: R30.P$2 0.97,19.35 0.64,19.68 0.64,23.81 1.51,24.69 IC4.1 3.17,26.35 4.13,27.3 13.79,27.3 14.55,26.54 14.55,24.82 EXPANSION.15 15.88,20 18.73,17.14 v18.73,15.24
  Bottom 0.254: v18.73,15.24 18.73,13.97 24.4,8.31 25.32,8.31 26.54,9.53 26.99,9.53 OUT.4
SIN-OUT  (via drill 0.25)
  Top 0.254: R42.P$1 5.41,3.48 5.08,3.81 5.08,4.45 | 5.08,4.45 5.08,7.62 5.64,8.18 IC5.1 | 5.08,4.45 12.96,4.45 12.98,4.47 13.93,5.36 v14.61,6.03 14.67,6.03 15.07,6.44 24.22,6.44 24.76,6.99 OUT.3 | EXPANSION.14 13.02,26.04 11.75,24.76 11.75,22.22 12.38,21.59 12.38,20.95 12.15,20.73 12.15,16.98 11.11,15.94 v11.11,15.24
  Bottom 0.254: v14.61,6.03 12.06,8.57 12.06,13.65 11.11,14.61 v11.11,15.24
SOFT-SYNC  (via drill 0.25)
  Top 0.254: C2.1 20.95,73.99 20.65,73.99 19.99,73.99 v19.68,74.3 | EXPANSION.10 13.02,31.43 12.06,31.43 v11.11,32.39
  Bottom 0.254: v11.11,32.39 10.79,32.7 10.79,36.51 10.79,39.37 11.48,40.06 14.16,40.06 14.55,40.45 14.55,42.55 14.55,48.59 19.58,53.62 19.58,54.71 18.73,55.56 18.73,61.59 20.32,63.18 20.32,73.66 v19.68,74.3
SOFT_SYNC_IN
  Top 0.254: IC2.9 18.41,64.77 19.99,66.34 R3.P$2
SYNC  (via drill 0.25)
  Top 0.254: v21.91,49.53 21.59,49.85 20.64,49.85 20.32,49.53 C1.1
  Bottom 0.254: CTRL.2 4.57,7.11 4.57,12.69 4.57,16 7.85,19.28 18.33,19.28 21.95,22.89 21.95,25.32 26.35,29.73 26.35,32.07 20.95,37.47 20.95,42.86 21.91,43.82 v21.91,49.53
TRI-OUT  (via drill 0.25)
  Top 0.254: v11.43,13.34 10.24,13.34 IC5.5 10.16,15.56 11.75,17.14 v11.75,21.27 | v4.76,37.47 3.81,36.51 R31.P$2 2.9,34.34 2.9,32.7 3.06,32.54 3.98,32.54 4.45,32.07 IC4.7 | OUT.5 26.04,10.79 20.95,10.79 19.05,8.89 v11.43,8.89
  Bottom 0.254: v11.43,8.89 v11.43,13.34 | EXPANSION.13 18.41,26.04 19.05,25.4 19.05,22.22 17.78,20.95 11.75,20.95 | v4.76,37.47 4.76,21.91 5.71,20.95 11.43,20.95 11.75,20.95 | v11.75,21.27 11.75,20.95
V/OCT  (via drill 0.25)
  Top 0.254: R15.P$2 6.35,76.52 6.67,76.83 v7.62,76.83
  Bottom 0.254: CTRL.3 4.17,9.25 4.17,15.52 2.31,17.37 2.31,17.78 2.31,42.71 1.91,43.12 1.91,48.89 5.4,52.38 5.4,60.33 3.17,62.55 3.17,72.39 v7.62,76.83
V/OCT-EXT  (via drill 0.25)
  Top 0.254: R16.P$2 8.26,75.56 v9.53,75.56 | EXPANSION.6 11.75,36.2 11.59,36.35 8.57,39.37 v8.26,39.37
  Bottom 0.254: v9.53,75.56 9.53,55.56 8.15,54.19 8.15,50.94 6.76,49.55 6.76,40.87 v8.26,39.37
VCO-PULSE
  Top 0.254: R27.P$1 16.51,45.4 | 16.51,45.4 14.61,45.4 R26.P$2 | IC3.3 25.4,33.55 25.4,38.42 18.41,45.4 17.46,45.4 16.51,45.4
VCO-SAW  (via drill 0.25)
  Top 0.254: v19.05,54.29 18.41,54.93 IC2.8 | C8.1 7.62,17.46 8.26,16.83 10.79,16.83 11.34,17.37 11.34,20.73 11.11,20.95 11.11,21.91 11.34,22.14 11.34,23.58 10.95,23.97 v10.48,24.45 | v9.84,42.55 5.4,42.55 4.76,41.91 4.76,39.37 6.03,38.1 7.62,38.1 9.84,35.88 9.84,30.4 v10.08,30.16
  Bottom 0.254: v19.05,54.29 19.05,53.66 17.67,52.28 12.49,52.28 11.22,51.01 11.22,43.92 v9.84,42.55 | v10.08,30.16 9.84,29.92 9.84,25.4 10.48,24.76 v10.48,24.45
VCO-TRI  (via drill 0.25)
  Top 0.254: v9.21,34.93 9.21,33.64 8.89,33.33 C9.1 | v17.14,65.09 IC2.10
  Bottom 0.254: v17.14,65.09 17.46,65.09 18.31,64.24 18.31,53.75 17.37,52.81 12.44,52.81 10.71,51.08 10.71,44.36 9.21,42.86 v9.21,34.93

### Text on the board
bPlace: POWER | -12 | +12 | -5 | +5 | V/OCT | GND | WIDTH | GND | S-SYNC | GND | -- | GND | SINE | TRI | PULSE | SAW
tRestrict: VCO3340 revC
bRestrict: VCO3340 revC